# EAGLE design charlieplexing-8-led-schematic (EAGLE 8.2.2)
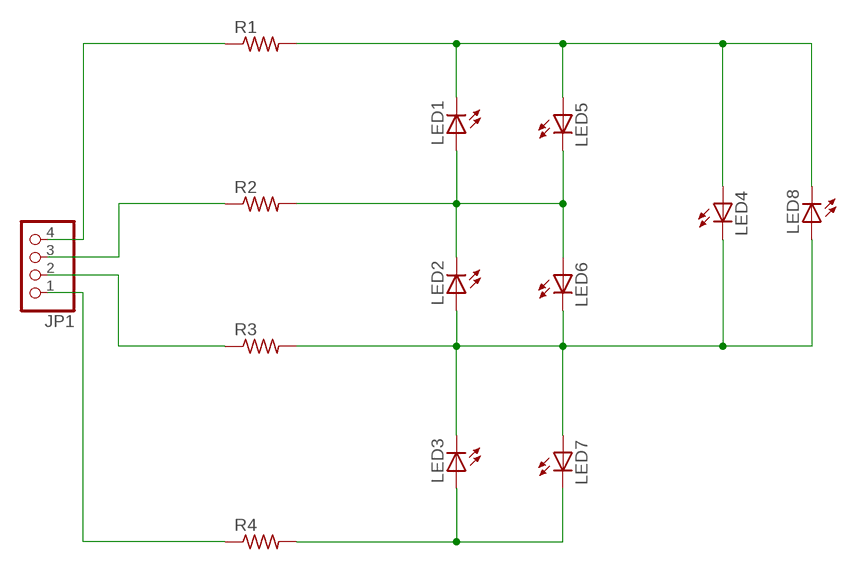
[diagram p0: schematic, sheet 1]

## Parts
JP1  PINHD-1X4  [1X04]
LED1  LED5MM  [LED5MM]
LED2  LED5MM  [LED5MM]
LED3  LED5MM  [LED5MM]
LED4  LED5MM  [LED5MM]
LED5  LED3MM  [LED3MM]
LED6  LED3MM  [LED3MM]
LED7  LED3MM  [LED3MM]
LED8  LED3MM  [LED3MM]
R1  R-US_0207/10  [0207/10]
R2  R-US_0207/10  [0207/10]
R3  R-US_0207/10  [0207/10]
R4  R-US_0207/10  [0207/10]

## Nets
N$2: LED1.A LED2.K(C) LED5.K(C) LED6.A R2.2
N$3: LED2.A LED3.K(C) LED4.K(C) LED6.K(C) LED7.A LED8.A R3.2
N$4: LED3.A LED7.K(C) R4.2
N$5: JP1.4 R1.1
N$6: JP1.3 R2.1
N$7: JP1.2 R3.1
N$8: JP1.1 R4.1
N$9: LED1.K(C) LED4.A LED5.A LED8.K(C) R1.2

## Library data of the parts
JP1 = pinhead:PINHD-1X4: PIN HEADER
LED1-LED8 = led:LED: LED OSRAM: - CHIPLED LG R971, LG N971, LY N971, LG Q971, LY Q971, LO R971, LY R971 LH N974, LH R974 LS Q976, LO Q976, LY Q976 LO Q996 - Hyper CHIPLED LW Q18S LB Q993, LB Q99A, LB R99A - SideLED LS A670, LO A670, LY A670, LG A670, LP A670 LB A673, LV A673, LT A673, LW A673 LH A674 LY A675 LS A676, LA A676, LO A676, LY A676, LW A676 LS A679, LY A679, LG A679 - Hyper Micro SIDELED® LS Y876, LA Y876, LO Y876, LY Y876 LT Y87S - SmartLED LW L88C, LW L88S LB L89C, LB L89S, LG L890 LS L89K, LO L89K, LY L89K LS L896, LA L896, LO L896, LY L896 - TOPLED LS T670, LO T670, LY T670, LG T670, LP T670 LSG T670, LSP T670, LSY T670, LOP T670, LYG T670 LG T671, LOG T671, LSG T671 LB T673, LV T673, LT T673, LW T673 LH T674 LS T676, LA T676, LO T676, LY T676, LB T676, LH T676, LSB T676, LW T676 LB T67C, LV T67C, LT T67C, LS T67K, LO T67K, LY T67K, LW E67C LS E67B, LA E67B, LO E67B, LY E67B, LB E67C, LV E67C, LT E67C LW T67C LS T679, LY T679, LG T679 LS T770, LO T770, LY T770, LG T770, LP T770 LB T773, LV T773, LT T773, LW T773 LH T774 LS E675, LA E675, LY E675, LS T675 LS T776, LA T776, LO T776, LY T776, LB T776 LHGB T686 LT T68C, LB T68C - Hyper Mini TOPLED® LB M676 - Mini TOPLED Santana® LG M470 LS M47K, LO M47K, LY M47K Source: http://www.osram.convergy.de LUXEON: - LUMILED® LXK2-PW12-R00, LXK2-PW12-S00, LXK2-PW14-U00, LXK2-PW14-V00 LXK2-PM12-R00, LXK2-PM12-S00, LXK2-PM14-U00 LXK2-PE12-Q00, LXK2-PE12-R00, LXK2-PE12-S00, LXK2-PE14-T00, LXK2-PE14-U00 LXK2-PB12-K00, LXK2-PB12-L00, LXK2-PB12-M00, LXK2-PB14-N00, LXK2-PB14-P00, LXK2-PB14-Q00 LXK2-PR12-L00, LXK2-PR12-M00, LXK2-PR14-Q00, LXK2-PR14-R00 LXK2-PD12-Q00, LXK2-PD12-R00, LXK2-PD12-S00 LXK2-PH12-R00, LXK2-PH12-S00 LXK2-PL12-P00, LXK2-PL12-Q00, LXK2-PL12-R00 Source: www.luxeon.com KINGBRIGHT: KA-3528ASYC Source: www.kingbright.com
R1-R4 = rcl:R-US_: RESISTOR, American symbol

## Board
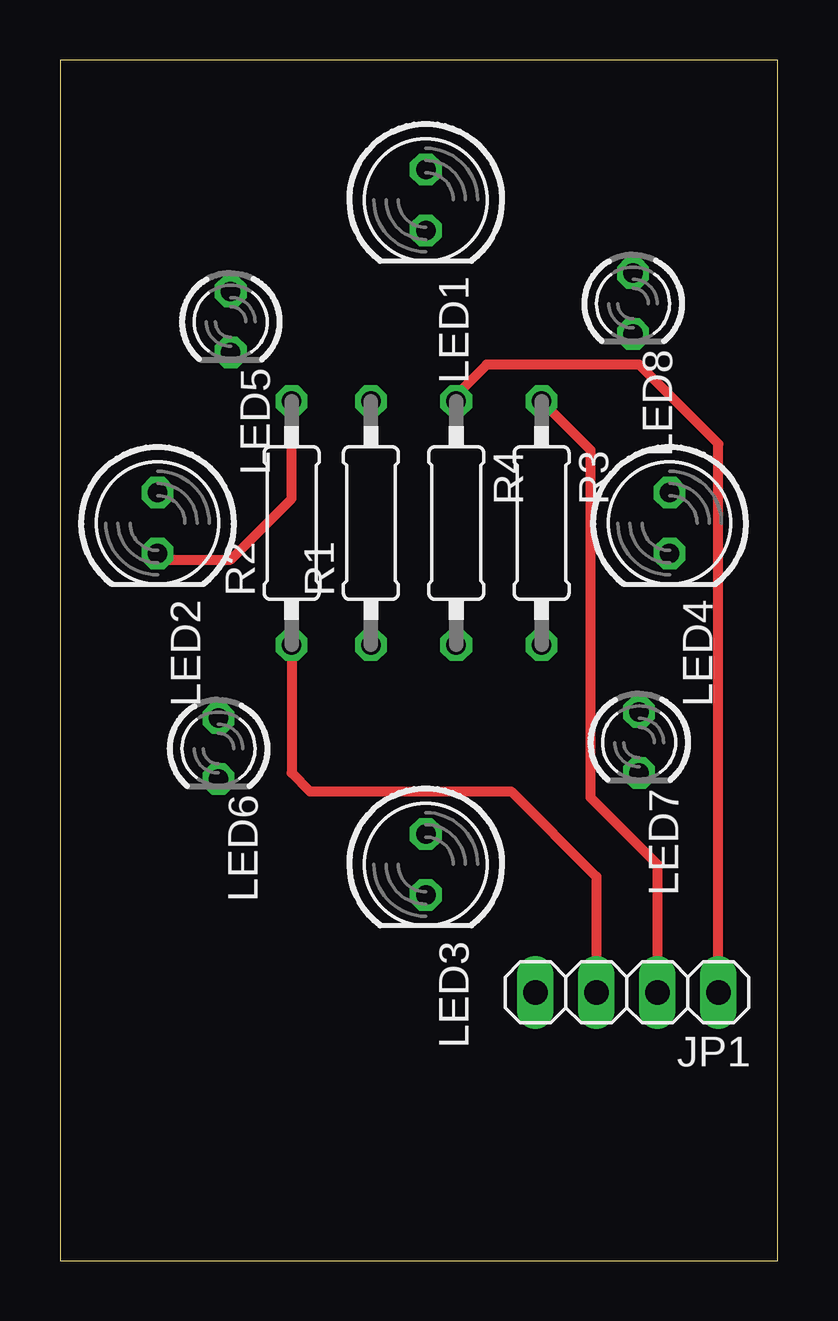
[diagram p1: board, top side]
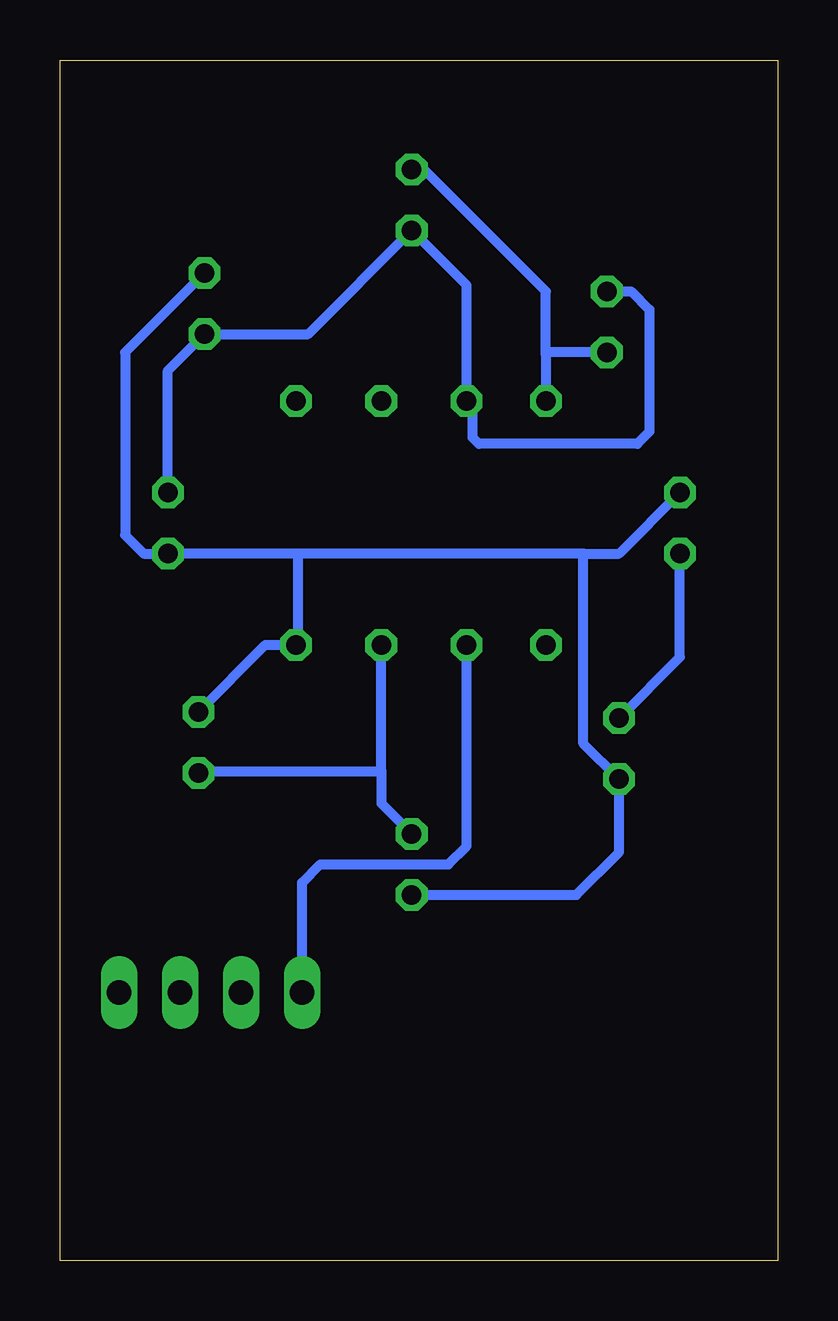
[diagram p2: board, bottom side, seen from below]

Size 29.9 x 50.03 mm. Coordinates in mm from the lower left corner, seen from the top.
Outline: 0,0 29.9,0 29.9,50.03 0,50.03 0,0
Copper layers (1*16): Top 0.035mm / dielectric 1.5mm / Bottom 0.035mm
Design rules "default": minimum track width 6mil, minimum drill 0.35mm, track to track 6mil, track to pad 6mil, pad to pad 6mil, via to via 6mil, smd to smd 6mil, copper to edge 40mil, drill to drill 6mil, minimum pad ring 10mil, minimum via ring 8mil, stop-mask expansion 4mil, vias tented up to drill 0mil, thermal gap 10mil

### Footprints (pad centres in the part's own frame; a part is rotated, then mirrored left to right if it is on the bottom)
1X04 = drill 1.016 long: 1 -3.81,0; 2 -1.27,0; 3 1.27,0; 4 3.81,0
LED5MM = drill 0.813 octagon: A -1.27,0; K 1.27,0
LED3MM = drill 0.813 octagon: A -1.27,0; K 1.27,0
0207/10 = drill 0.813 octagon: 1 -5.08,0; 2 5.08,0

### Placement (x,y rotation side)
JP1  23.62,11.18 180 top
LED1  15.24,44.2 270 top
LED2  4.06,30.73 270 top
LED3  15.24,16.51 270 top
LED4  25.4,30.73 270 top
LED5  7.11,39.12 270 top
LED6  6.6,21.34 270 top
LED7  24.13,21.59 270 top
LED8  23.88,39.88 270 top
R1  12.95,30.73 90 top
R2  9.65,30.73 90 top
R3  20.07,30.73 270 top
R4  16.51,30.73 270 top

### Tracks (layer width: path | path; a pad name or v marks a point on that pad's centre or on a via)
N$2
  Top 0.406: LED2.K 4.32,29.21 7.11,29.21 9.65,31.75 R2.2
  Bottom 0.406: LED1.A 14.73,45.47 9.65,40.39 9.65,37.73 | 9.65,37.73 R2.2 | LED5.K 9.54,37.85 9.65,37.73 | LED6.A 4.06,25.15 LED2.K
N$3
  Bottom 0.406: LED2.A 6.6,29.46 8.09,29.46 | 19.96,29.46 LED4.K 26.42,29.46 27.18,30.23 27.18,37.85 LED8.A | 8.09,29.46 19.96,29.46 | LED7.A 21.34,25.65 R3.2 19.96,25.76 19.96,29.46 | LED3.K 8.38,15.24 6.6,17.02 LED6.K 8.09,21.55 8.09,29.46
N$4
  Bottom 0.406: LED3.A 16.51,19.05 16.51,20.4 | 16.51,20.4 R4.2 | LED7.K 24.05,20.4 16.51,20.4
N$5
  Bottom 0.406: JP1.4 19.81,15.75 19.05,16.51 13.72,16.51 12.95,17.27 R1.1
N$6
  Top 0.406: R2.1 9.65,20.32 10.41,19.56 18.8,19.56 22.35,16 JP1.3
N$7
  Top 0.406: R3.1 22.1,33.78 22.1,19.3 24.89,16.51 JP1.2
N$8
  Top 0.406: JP1.1 27.43,34.04 24.13,37.34 17.78,37.34 16.51,36.07 R4.1
N$9
  Bottom 0.406: LED5.A 6.1,40.39 5.33,39.62 5.33,34.54 5.84,34.04 12.45,34.04 12.7,34.29 12.7,35.56 R1.2 12.95,40.64 LED1.K 19.56,38.61 LED8.K 25.4,37.08 LED4.A